# EAGLE design MOSFET breakout (EAGLE 7.3.0)
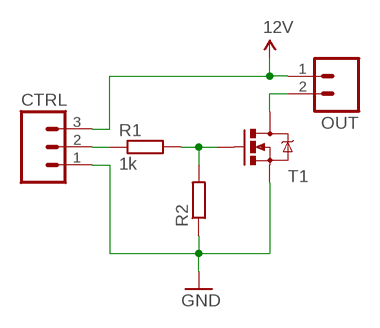
[diagram p0: schematic, sheet 1]

## Parts
CTRL  M03PTH  [1X03]
OUT  M02PTH  [1X02]
R1  1k  RESISTOR-0603  [R603]
R2  RESISTOR-0603  [R603]
T1  MOSFET-NCHANNELFDD8780  [DPAK]

## Nets
12V: CTRL.3 OUT.1
GND: CTRL.1 R2.1 T1.3(S)
N$1: R1.2 R2.2 T1.1(G)
N$2: CTRL.2 R1.1
N$4: OUT.2 T1.4(D)

## Library data of the parts
CTRL = SparkFun-Connectors:M03: Header 3 Standard 3-pin 0.1" header. Use with straight break away headers (SKU : PRT-00116), right angle break away headers (PRT-00553), swiss pins (PRT-00743), machine pins (PRT-00117), and female headers (PRT-00115). Molex polarized connector foot print use with SKU : PRT-08232 with associated crimp pins and housings.
OUT = SparkFun-Connectors:M02: Standard 2-pin 0.1" header. Use with - straight break away headers ( PRT-00116) - right angle break away headers (PRT-00553) - swiss pins (PRT-00743) - machine pins (PRT-00117) - female headers (PRT-00115) Molex polarized connector foot print use with: PRT-08233 with associated crimp pins and housings. 2.54_SCREWTERM for use with PRT-10571. 3.5mm Screw Terminal footprints for PRT-08084 5mm Screw Terminal footprints for use with PRT-08432
R1 R2 = dp_devices:RESISTOR
T1 = SparkFun-DiscreteSemi:MOSFET-NCHANNEL: Common NMOSFET Parts MFG P/N Store ID Prod ID FDD8780 TRANS-09984 SI7820DN TRANS-11055 FDS6630A IC-08089 2N7002PW TRANS-11151 FQP30N06L COM-10213 TRANS-10060 BSS123LT1G TRANS-08345 BSS138 TRANS-00830 BS170 2N7000; PROD_ID: TRANS-09984

## Board
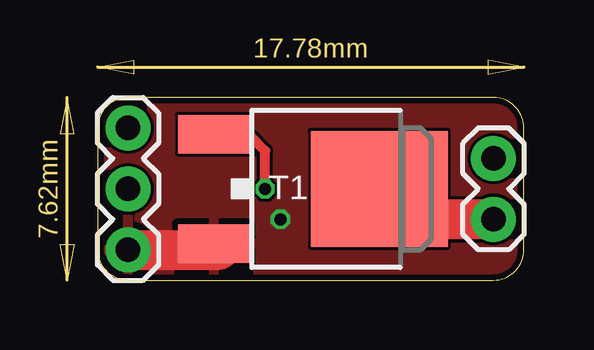
[diagram p1: board, top side]
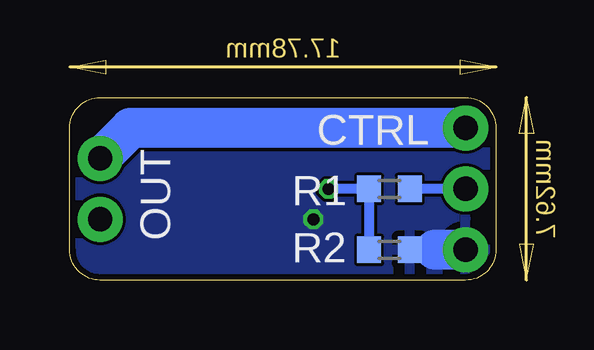
[diagram p2: board, bottom side, seen from below]

Size 17.78 x 7.62 mm. Coordinates in mm from the lower left corner, seen from the top.
Outline: 0,6.35 0,1.27 arc90 1.27,0 16.51,0 arc90 17.78,1.27 17.78,6.35 arc90 16.51,7.62 1.27,7.62 arc90 0,6.35
Copper layers (1*16): Top 0.035mm / dielectric 1.5mm / Bottom 0.035mm
Design rules "dirt_cheap_dirty_boards.v1": minimum track width 5mil, minimum drill 12mil, track to track 5mil, track to pad 5mil, pad to pad 5mil, via to via 5mil, smd to smd 0mil, copper to edge 10mil, drill to drill 10mil, minimum pad ring 10mil, minimum via ring 6mil, stop-mask expansion 2mil, vias tented up to drill 25mil, thermal gap 10mil

### Footprints (pad centres in the part's own frame; a part is rotated, then mirrored left to right if it is on the bottom)
1X03 = drill 1.016 pad 1.88: 1 0,0; 2 2.54,0; 3 5.08,0
1X02 = drill 1.016 pad 1.88: 1 0,0; 2 2.54,0
R603 = smd 1 x 1.1: 1 -0.85,0; 2 0.85,0
DPAK = smd 1.6 x 3: 1 -2.28,-5.31; 3 2.28,-5.31 | smd 4.826 x 5.715: 4 0,1.588

### Placement (x,y rotation side)
CTRL  1.27,1.27 90 top
OUT  16.51,5.08 270 top
R1  4.45,3.81 180 bottom
R2  4.45,1.27 180 bottom
T1  10.16,3.81 270 top

### Tracks (layer width: path | path; a pad name or v marks a point on that pad's centre or on a via)
12V
  Bottom 1.676: CTRL.3 15.24,6.35 OUT.1
GND  (via drill 0.5)
  Top 1.676: CTRL.1 5.08,1.27
  Bottom 1.676: CTRL.1 2.54,1.27
  other vias: 7.62,2.54
  pour Bottom: 0,7.62 17.78,7.62 17.78,0 0,0
  pour Top: 0,7.62 17.78,7.62 17.78,0 0,0
N$1  (via drill 0.5)
  Top 0.406: v6.99,3.81 6.99,5.4 6.35,6.03 4.91,6.03 T1.1
  Bottom 0.406: R2.2 R1.2 v6.99,3.81
N$2
  Bottom 0.406: CTRL.2 R1.1
N$4
  Top 1.676: OUT.2 13.02,2.54 T1.4